# EAGLE schematic ADC_LED (EAGLE 7.4.0)
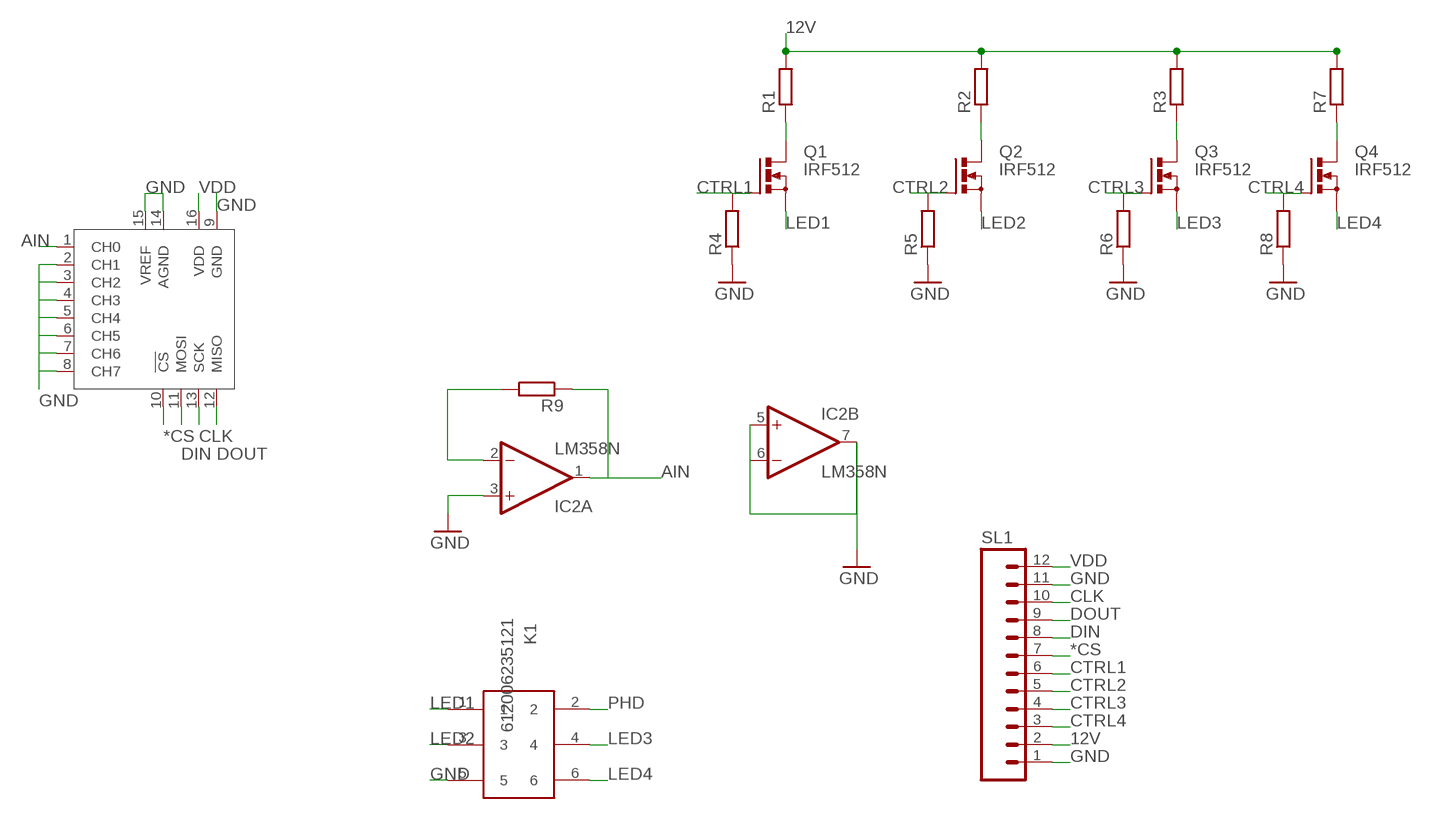
[diagram p0: schematic, sheet 1]

## Parts
IC2  LM358N  [DIL08]
K1  612006235121  [612006235121]
Q1  IRF512  [TO220BV]
Q2  IRF512  [TO220BV]
Q3  IRF512  [TO220BV]
Q4  IRF512  [TO220BV]
R1  R-EU_0204/7  [0204/7]
R2  R-EU_0204/7  [0204/7]
R3  R-EU_0204/7  [0204/7]
R4  R-EU_0204/7  [0204/7]
R5  R-EU_0204/7  [0204/7]
R6  R-EU_0204/7  [0204/7]
R7  R-EU_0204/7  [0204/7]
R8  R-EU_0204/7  [0204/7]
R9  R-EU_0204/7  [0204/7]
SL1  M12  [12P]
U$2  MCP3008P  [DIL16]

## Nets
12V: R1.2 R2.2 R3.2 R7.2 SL1.2
*CS: SL1.7 U$2.10(!CS)
AIN: IC2.1(A:OUT) R9.1 U$2.1(CH0)
CLK: SL1.10 U$2.13(SCK)
CTRL1: Q1.G R4.2 SL1.6
CTRL2: Q2.G R5.2 SL1.5
CTRL3: Q3.G R6.2 SL1.4
CTRL4: Q4.G R8.2 SL1.3
DIN: SL1.8 U$2.11(MOSI)
DOUT: SL1.9 U$2.12(MISO)
GND: IC2.3(A:+IN) IC2.5(B:+IN) IC2.6(B:-IN) IC2.7(B:OUT) K1.5 R4.1 R5.1 R6.1 R8.1 SL1.1 SL1.11 U$2.2(CH1) U$2.3(CH2) U$2.4(CH3) U$2.5(CH4) U$2.6(CH5) U$2.7(CH6) U$2.8(CH7) U$2.9(GND) U$2.14(AGND) U$2.15(VREF)
LED1: K1.1 Q1.S
LED2: K1.3 Q2.S
LED3: K1.4 Q3.S
LED4: K1.6 Q4.S
N$1: Q1.D R1.1
N$2: Q2.D R2.1
N$9: Q3.D R3.1
N$20: Q4.D R7.1
PHD: IC2.2(A:-IN) K1.2 R9.2
VDD: SL1.12 U$2.16(VDD)

## Power pins joined to a net without a drawn wire
V+: IC2.8(P:V+)
V-: IC2.4(P:V-)

## Library data of the parts
IC2 = linear:LM358: OP AMP also LM158; LM258; LM2904 Source: http://cache.national.com/ds/LM/LM158.pdf
K1 = Wurth_Elektronik_Electromechanic_Wire_to_Board_Connectors_rev15c:612006235121: WR-BHD 2.54mm Male Box Header High Temperature, 6 Pins=>Code : Con_WTB_BHD_2.54_Male_THT_RS_612006235121 <http://katalog.we-online.de/media/thumbs2/eican/thb_Con_WTB_BHD_2.54_Male_THT_RS_6120xx235121_pf2.jpg> Details see: http://katalog.we-online.de/en/em/612_0xx_235_121 Created 2014-06-05, Karrer Zheng 2014 (C) Würth Elektronik
Q1-Q4 = transistor-power:IRF512: N-CHANNEL MOS FET
R1-R9 = resistor:R-EU_: RESISTOR, European symbol
SL1 = con-amp-quick:M12: AMP QUICK CONNECTOR; OC_FARNELL: unknown; OC_NEWARK: unknown
U$2 = MCP3008:MCP3008